# EAGLE design LSA2 (EAGLE 6.6.0)
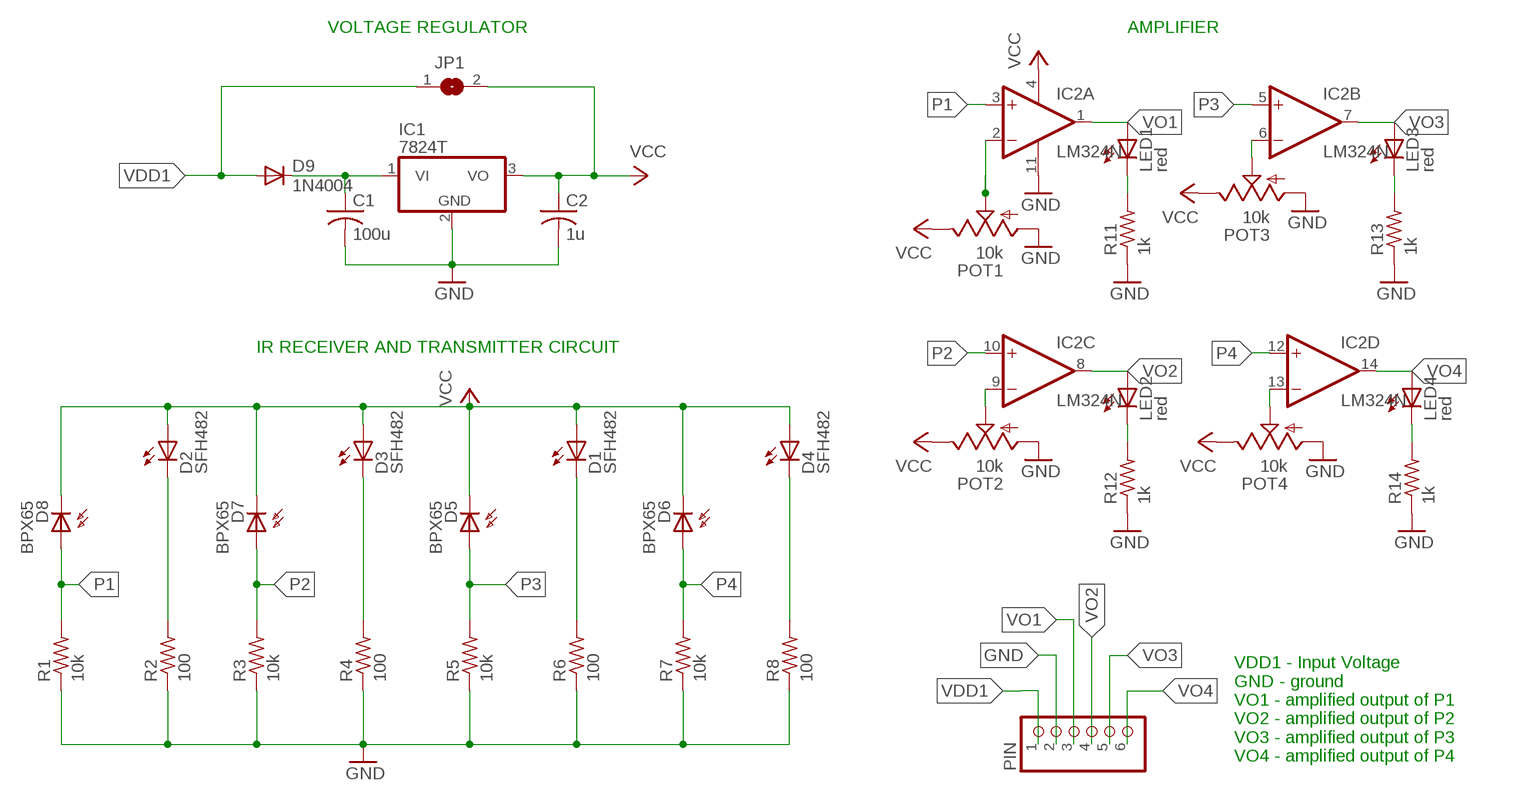
[diagram p0: schematic, sheet 1]

## Parts
C1  100u  C-USC0805  [C0805]
C2  1u  C-USC0805  [C0805]
D1  SFH482  [SFH482]
D2  SFH482  [SFH482]
D3  SFH482  [SFH482]
D4  SFH482  [SFH482]
D5  BPX65  [BPX65]
D6  BPX65  [BPX65]
D7  BPX65  [BPX65]
D8  BPX65  [BPX65]
D9  1N4004  [DO41-10]
IC1  7824T  [TO220H]
IC2  LM324N  [DIL14]
JP1  SJW  [SJW]
LED1  red  LED  [SMARTLED-TTW]
LED2  red  LED  [SMARTLED-TTW]
LED3  red  LED  [SMARTLED-TTW]
LED4  red  LED  [SMARTLED-TTW]
PIN  PINHD-1X6/90  [1X06/90]
POT1  10k  TRIM  [6MM]
POT2  10k  TRIM  [6MM]
POT3  10k  TRIM  [6MM]
POT4  10k  TRIM  [6MM]
R1  10k  R-US_M0805  [M0805]
R2  100  R-US_M0805  [M0805]
R3  10k  R-US_M0805  [M0805]
R4  100  R-US_M0805  [M0805]
R5  10k  R-US_M0805  [M0805]
R6  100  R-US_M0805  [M0805]
R7  10k  R-US_M0805  [M0805]
R8  100  R-US_M0805  [M0805]
R11  1k  R-US_M0805  [M0805]
R12  1k  R-US_M0805  [M0805]
R13  1k  R-US_M0805  [M0805]
R14  1k  R-US_M0805  [M0805]

## Nets
D5: D1.K(C) R6.2
GND: C1.2 C2.2 IC1.2(GND) IC2.11(P:V-) PIN.2 POT1.A POT2.A POT3.A POT4.A R11.1 R12.1 R13.1 R14.1
N$1: C1.1 D9.C IC1.1(VI)
N$2: D2.K(C) R2.2
N$4: D3.K(C) R4.2
N$8: D4.K(C) R8.2
N$16: IC2.2(A:-IN) POT1.S
N$17: IC2.6(B:-IN) POT3.S
N$19: IC2.13(D:-IN) POT4.S
N$21: LED2.C@1(C) R12.2
N$22: LED4.C@1(C) R14.2
N$25: LED3.C@1(C) R13.2
N$27: LED1.C@1(C) R11.2
P1: D8.A IC2.3(A:+IN) R1.2
P2: D7.A IC2.10(C:+IN) R3.2
P3: D5.A IC2.5(B:+IN) R5.2
P4: D6.A IC2.12(D:+IN) R7.2
POT2: IC2.9(C:-IN) POT2.S
R6: R1.1 R2.1 R3.1 R4.1 R5.1 R6.1 R7.1 R8.1 ; supply symbol labelled GND
VCC: C2.1 D1.A D2.A D3.A D4.A D5.K(C) D6.K(C) D7.K(C) D8.K(C) IC1.3(VO) IC2.4(P:V+) JP1.2 POT1.E POT2.E POT3.E POT4.E
VDD1: D9.A JP1.1 PIN.1
VO1: IC2.1(A:OUT) LED1.A@1(A) PIN.3
VO2: IC2.8(C:OUT) LED2.A@1(A) PIN.4
VO3: IC2.7(B:OUT) LED3.A@1(A) PIN.5
VO4: IC2.14(D:OUT) LED4.A@1(A) PIN.6

## Notes on the sheet
- VOLTAGE REGULATOR | AMPLIFIER
- IR RECEIVER AND TRANSMITTER CIRCUIT
- VDD1 - Input Voltage 
  GND - ground
  VO1 - amplified output of P1 
  VO2 - amplified output of P2
  VO3 - amplified output of P3
  VO4 - amplified output of P4

## Library data of the parts
C1 C2 = adafruit:C-US: CAPACITOR, American symbol
D1-D4 = led:SFH482: IR LED infrared emitting diode, Infineon
D5-D8 = opto-trans-siemens:BPX65: PHOTO DIODE; MPN: BPX65.; OC_FARNELL: 327451; OC_NEWARK: 06WX2764
D9 = adafruit:1N4004: DIODE General purpose 1N400x type rectifier (With bigger pads) http://www.ladyada.net/library/pcb/eaglelibrary.html
IC1 = linear:78*: Positive VOLTAGE REGULATOR Source: http://cache.national.com/ds/LM/LM78L05.pdf http://www.fairchildsemi.com/ds/LM/LM7805.pdf
IC2 = linear:LM324: OP AMP
JP1 = jumper:SJ: SMD solder JUMPER
LED1-LED4 = adafruit:LED: LED OSRAM: - CHIPLED LG R971, LG N971, LY N971, LG Q971, LY Q971, LO R971, LY R971 LH N974, LH R974 LS Q976, LO Q976, LY Q976 LO Q996 - Hyper CHIPLED LW Q18S LB Q993, LB Q99A, LB R99A - SideLED LS A670, LO A670, LY A670, LG A670, LP A670 LB A673, LV A673, LT A673, LW A673 LH A674 LY A675 LS A676, LA A676, LO A676, LY A676, LW A676 LS A679, LY A679, LG A679 - Hyper Micro SIDELED® LS Y876, LA Y876, LO Y876, LY Y876 LT Y87S - SmartLED LW L88C, LW L88S LB L89C, LB L89S, LG L890 LS L89K, LO L89K, LY L89K LS L896, LA L896, LO L896, LY L896 - TOPLED LS T670, LO T670, LY T670, LG T670, LP T670 LSG T670, LSP T670, LSY T670, LOP T670, LYG T670 LG T671, LOG T671, LSG T671 LB T673, LV T673, LT T673, LW T673 LH T674 LS T676, LA T676, LO T676, LY T676, LB T676, LH T676, LSB T676, LW T676 LB T67C, LV T67C, LT T67C, LS T67K, LO T67K, LY T67K, LW E67C LS E67B, LA E67B, LO E67B, LY E67B, LB E67C, LV E67C, LT E67C LW T67C LS T679, LY T679, LG T679 LS T770, LO T770, LY T770, LG T770, LP T770 LB T773, LV T773, LT T773, LW T773 LH T774 LS E675, LA E675, LY E675, LS T675 LS T776, LA T776, LO T776, LY T776, LB T776 LHGB T686 LT T68C, LB T68C - Hyper Mini TOPLED® LB M676 - Mini TOPLED Santana® LG M470 LS M47K, LO M47K, LY M47K Source: http://www.osram.convergy.de/
PIN = pinhead:PINHD-1X6: PIN HEADER
POT1-POT4 = adafruit:TRIM
R1-R8 R11-R14 = adafruit:R-US_: RESISTOR, American symbol

## Net classes
0 default: width 0.305 mm, drill 0.635 mm, clearance 0.254 mm

## Board
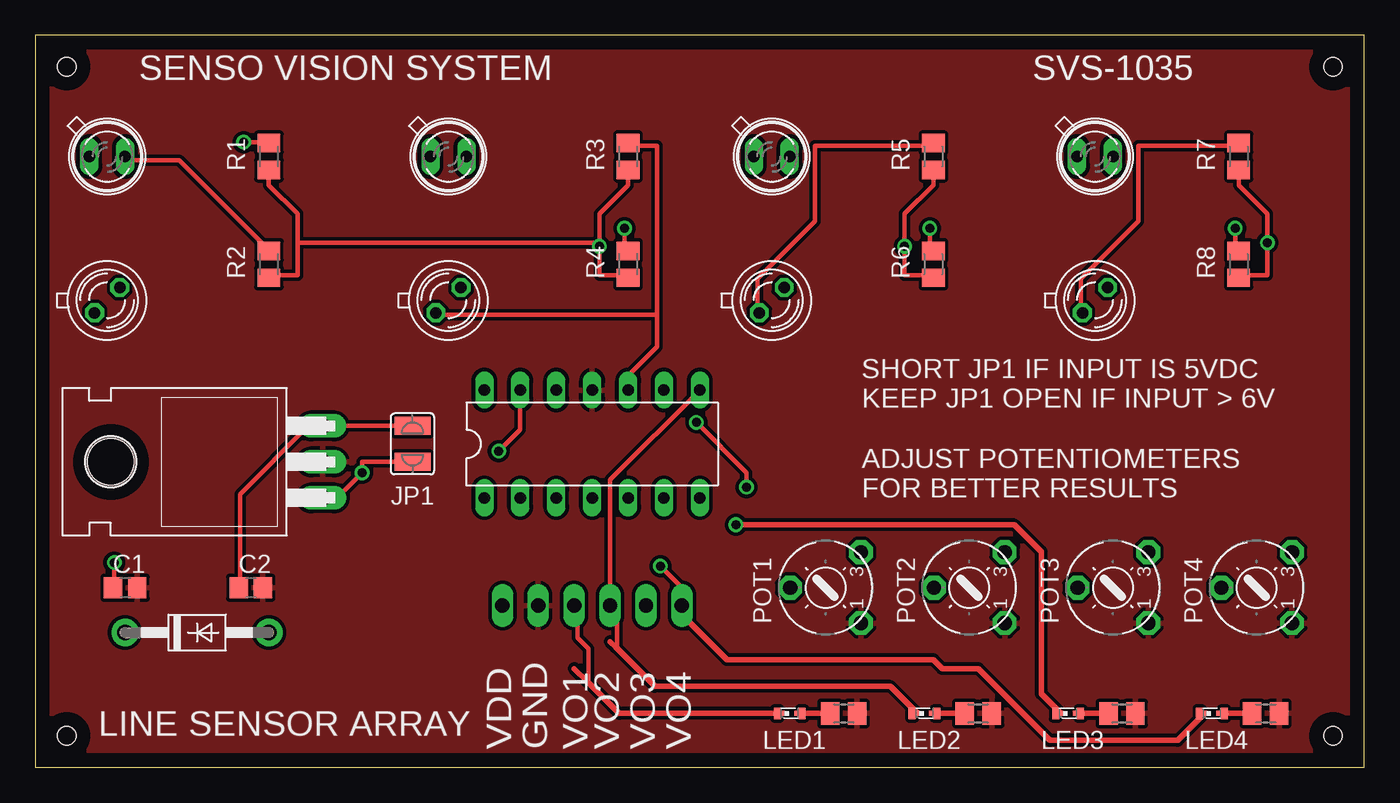
[diagram p1: board, top side]
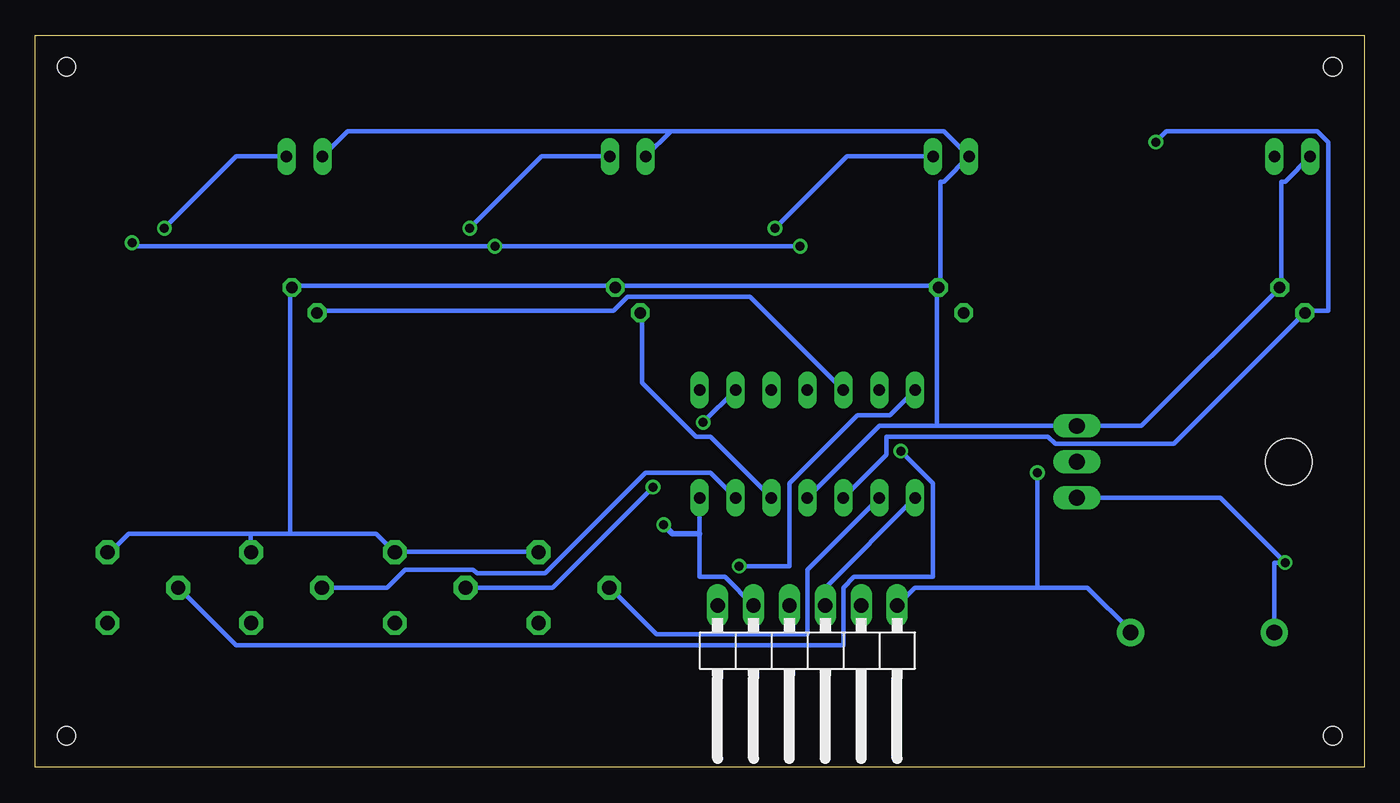
[diagram p2: board, bottom side, seen from below]

Size 93.96 x 51.74 mm. Coordinates in mm from the lower left corner, seen from the top.
Outline: 0,0 93.96,0 93.96,51.74 0,51.74 0,0
Copper layers (1*16): Top 0.035mm / dielectric 1.5mm / Bottom 0.035mm
Design rules "default": minimum track width 10mil, minimum drill 24mil, track to track 8mil, track to pad 8mil, pad to pad 8mil, via to via 8mil, smd to smd 8mil, copper to edge 40mil, drill to drill 8mil, minimum pad ring 10mil, minimum via ring 8mil, stop-mask expansion 4mil, vias tented up to drill 0mil, thermal gap 10mil
Holes 1.3 mm at 2.22,2.22 2.22,49.53 91.76,49.53 91.76,2.22

### Footprints (pad centres in the part's own frame; a part is rotated, then mirrored left to right if it is on the bottom)
C0805 = smd 1.3 x 1.5: 1 -0.85,0; 2 0.85,0
SFH482 = drill 0.813 long: A -1.27,0; K 1.27,0
BPX65 = drill 0.813 octagon: A -0.889,-0.889; K 0.889,0.889
DO41-10 = drill 1.118 pad 1.93: A 5.08,0; C -5.08,0
TO220H = drill 1.118 long: 1 -2.54,-10.16; 2 0,-10.16; 3 2.54,-10.16 | hole 3.302: 0,4.826
DIL14 = drill 0.813 long: 1 -7.62,-3.81; 2 -5.08,-3.81; 3 -2.54,-3.81; 4 0,-3.81; 5 2.54,-3.81; 6 5.08,-3.81; 7 7.62,-3.81; 8 7.62,3.81; 9 5.08,3.81; 10 2.54,3.81; 11 0,3.81; 12 -2.54,3.81; 13 -5.08,3.81; 14 -7.62,3.81
SJW = smd 1.27 x 2.54: 1 -1.27,0; 2 1.27,0
SMARTLED-TTW = smd 0.8 x 0.5: A 0,-0.875; C 0,0.875 | smd 0.35 x 0.35: A@1 0,-0.5; C@1 0,0.5
1X06/90 = drill 1.016 long: 1 -6.35,-3.81; 2 -3.81,-3.81; 3 -1.27,-3.81; 4 1.27,-3.81; 5 3.81,-3.81; 6 6.35,-3.81
6MM = drill 1 pad 1.676 octagon: A -2.5,-2.5; E 2.5,-2.5; S 0,2.5
M0805 = smd 1.3 x 1.6: 1 -0.95,0; 2 0.95,0

### Placement (x,y rotation side)
C1  6.35,12.7 0 top
C2  15.24,12.7 0 top
D1  52.07,43.18 0 top
D2  5.08,43.18 0 top
D3  29.21,43.18 0 top
D4  74.93,43.18 0 top
D5  52.07,33.02 0 top
D6  74.93,33.02 0 top
D7  29.21,33.02 0 top
D8  5.08,33.02 0 top
D9  11.43,9.53 0 top
IC1  10.16,21.59 90 top
IC2  39.37,22.86 0 top
JP1  26.67,22.86 90 top
LED1  53.34,3.81 270 top
LED2  62.87,3.81 270 top
LED3  73.03,3.81 270 top
LED4  83.19,3.81 270 top
PIN  39.37,7.62 180 bottom
POT1  55.88,12.7 90 top
POT2  66.04,12.7 90 top
POT3  76.2,12.7 90 top
POT4  86.36,12.7 90 top
R1  16.51,43.18 90 top
R2  16.51,35.56 90 top
R3  41.91,43.18 90 top
R4  41.91,35.56 90 top
R5  63.5,43.18 90 top
R6  63.5,35.56 90 top
R7  85.09,43.18 90 top
R8  85.09,35.56 90 top
R11  57.15,3.81 180 top
R12  66.67,3.81 180 top
R13  76.83,3.81 180 top
R14  87,3.81 180 top

### Tracks (layer width: path | path; a pad name or v marks a point on that pad's centre or on a via)
D5  (via drill 0.64)
  Top 0.305: v63.25,38.1 63.25,36.83 63.5,36.58 R6.2
  Bottom 0.305: v63.25,38.1 58.17,43.18 D1.K
GND
  pour Top: -1.27,53.34 -1.27,-2.54 95.25,-2.54 95.25,53.34
N$1  (via drill 0.64)
  Top 0.305: v5.59,14.48 5.59,12.7 C1.1
  Bottom 0.305: IC1.1 10.16,19.05 v5.59,14.48 6.35,14.48 D9.C
N$2
  Top 0.305: D2.K 6.35,42.93 10.16,42.93 16.51,36.58 R2.2
N$4  (via drill 0.64)
  Top 0.305: v41.66,38.1 41.66,36.83 41.91,36.58 R4.2
  Bottom 0.305: v41.66,38.1 36.58,43.18 D3.K
N$8  (via drill 0.64)
  Top 0.305: v84.84,38.1 84.84,36.83 85.09,36.58 R8.2
  Bottom 0.305: v84.84,38.1 79.76,43.18 D4.K
N$16
  Bottom 0.305: IC2.2 39.37,13.97 39.37,9.4 50.04,9.4 53.34,12.7 POT1.S
N$17
  Bottom 0.305: IC2.6 46.23,20.83 50.8,20.83 57.91,13.72 62.74,13.72 62.99,13.97 67.82,13.97 69.09,12.7 POT3.S
N$19  (via drill 0.64)
  Top 0.305: IC2.13 34.29,23.88 v32.77,22.35
  Bottom 0.305: v32.77,22.35 30.48,20.07 30.48,13.46 36.07,13.46 36.83,12.7 36.83,8.64 79.76,8.64 83.82,12.7 POT4.S
N$21
  Top 0.406: LED2.C@1 R12.2
N$22
  Top 0.406: LED4.C@1 R14.2
N$25
  Top 0.406: LED3.C@1 R13.2
N$27
  Top 0.406: LED1.C@1 R11.2
P1  (via drill 0.64)
  Top 0.305: v14.73,44.2 16.51,44.2 R1.2
  Bottom 0.305: v14.73,44.2 13.97,44.96 3.3,44.96 2.54,44.2 2.54,32.26 4.06,32.26 D8.A 13.46,22.86 21.84,22.86 22.35,23.37 33.78,23.37 33.78,22.1 IC2.3
P2
  Top 0.305: 43.94,32 43.94,29.72 41.91,27.69 IC2.10 | 43.94,32 43.94,43.94 41.91,43.94 R3.2 | 43.94,32 28.45,32 D7.A
P3
  Top 0.305: R5.2 63.5,43.94 55.12,43.94 55.12,38.61 51.05,34.54 51.05,32.26 D5.A
  Bottom 0.305: IC2.5 46.23,23.37 47.24,23.37 51.05,27.18 51.05,32 D5.A
P4
  Top 0.305: R7.2 85.09,43.94 77.98,43.94 77.98,38.61 73.91,34.54 73.91,32.26 D6.A
  Bottom 0.305: IC2.12 43.43,33.27 52.07,33.27 53.09,32.26 73.91,32.26 D6.A
POT2  (via drill 0.64)
  Top 0.305: v46.74,24.38 50.29,20.83 v50.29,19.81
  Bottom 0.305: v46.74,24.38 IC2.9 | v50.29,19.81 57.4,12.7 POT2.S
R6  (via drill 0.64)
  Top 0.305: R7.1 85.09,41.15 87.12,39.12 v87.12,37.08 87.12,34.8 85.09,34.8 R8.1 | R5.1 63.5,41.15 61.47,39.12 v61.47,36.83 61.47,34.8 63.5,34.8 R6.1 | 18.54,37.08 18.54,39.12 16.51,41.15 R1.1 | 18.54,37.08 18.54,34.8 16.51,34.8 R2.1 | 39.88,37.08 39.88,39.12 41.91,41.15 R3.1 | 39.88,37.08 v39.88,36.83 39.88,34.8 41.91,34.8 R4.1 | 39.88,37.08 18.54,37.08
  Bottom 0.305: v39.88,36.83 v61.47,36.83 86.87,36.83 v87.12,37.08
VCC
  Top 0.305: C2.1 14.48,12.7 14.48,19.3 19.3,24.13 IC1.3 JP1.2
  Bottom 0.305: POT1.E 58.42,15.24 68.33,15.24 POT2.E 69.85,16.51 75.95,16.51 | 75.95,16.51 78.74,16.51 | 78.74,16.51 87.38,16.51 88.65,15.24 POT4.E | 75.95,16.51 75.95,33.78 D6.K 75.69,34.04 53.09,34.04 D5.K 52.83,34.04 30.23,34.04 D7.K | D7.K 29.97,34.04 29.97,41.4 29.72,41.4 D3.A 29.72,44.96 49.02,44.96 | 49.02,44.96 D1.A | D4.A 71.88,44.96 49.02,44.96 | D2.A 5.59,41.4 5.84,41.4 5.84,34.04 D8.K 15.75,24.13 IC1.3 30.23,24.13 | IC2.4 34.29,24.13 30.23,24.13 | 30.23,24.13 30.23,33.78 D7.K | 78.74,16.51 78.74,15.24 POT3.E
VDD1  (via drill 0.64)
  Top 0.305: JP1.1 23.11,21.59 v23.11,20.83 21.34,19.05
  Bottom 0.305: PIN.1 31.75,12.7 23.11,12.7 | 23.11,12.7 19.56,12.7 16.51,9.65 D9.A | 23.11,12.7 v23.11,20.83
VO1
  Top 0.305: PIN.3 38.35,11.18 38.35,9.14 39.12,8.38 39.12,6.1 39.05,6.03
  Top 0.406: LED1.A@1 41.27,3.81 39.05,6.03 38.1,6.99
  Bottom 0.305: IC2.1 38.1,12.7 PIN.3
VO2
  Top 0.305: IC2.8 40.64,20.32 PIN.4 41.15,10.92 41.15,8.64 41.02,8.51
  Top 0.406: LED2.A@1 60.46,5.71 43.81,5.71 41.02,8.51 40.64,8.89
VO3  (via drill 0.64)
  Top 0.406: LED3.A@1 71.12,5.21 71.12,15.24 69.22,17.14 v49.53,17.14
  Bottom 0.305: IC2.7 46.99,16.51 46.99,13.46 45.21,13.46 PIN.5
  Bottom 0.406: v49.53,17.14 48.9,16.51 46.99,16.51
VO4  (via drill 0.64)
  Top 0.305: v44.2,14.22 45.72,12.7 PIN.6 45.72,10.79
  Top 0.406: LED4.A@1 80.78,1.91 71.75,1.91 66.67,6.99 64.14,6.99 63.5,7.62 48.9,7.62 45.72,10.79
  Bottom 0.305: IC2.14 33.53,24.89 35.81,24.89 40.64,20.07 40.64,14.22 v44.2,14.22

### Text on the board
tPlace: SENSO VISION SYSTEM | SVS-1035 | SHORT JP1 IF INPUT IS 5VDC / KEEP JP1 OPEN IF INPUT > 6V | ADJUST POTENTIOMETERS / FOR BETTER RESULTS | LINE SENSOR ARRAY | VDD | GND | VO1 | VO2 | VO3 | VO4